# EAGLE design DOE PCB Schematics (EAGLE 9.5.2)
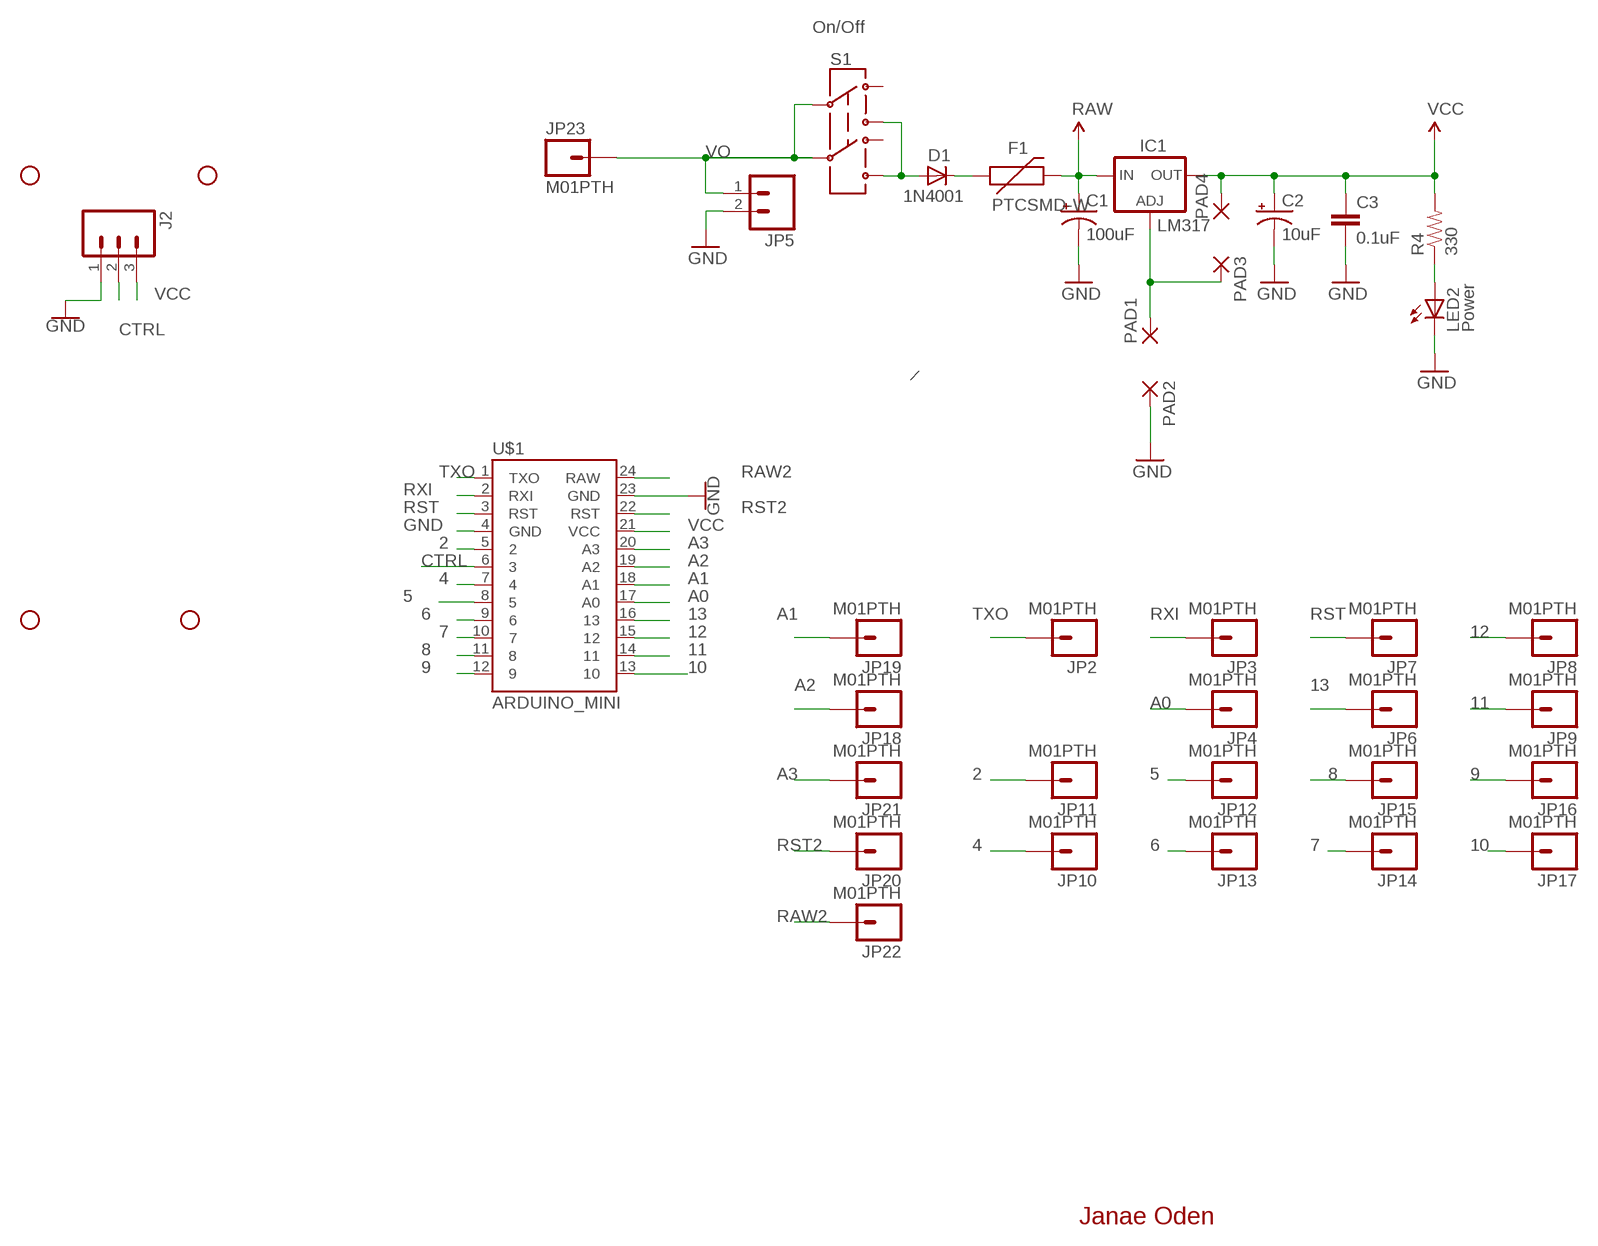
[diagram p0: schematic, sheet 1]

## Parts
C1  100uF  CAP_POL7343  [EIA7343]
C2  10uF  CAP_POL1206  [EIA3216]
C3  0.1uF  CAP0603-CAP  [0603-CAP]
D1  1N4001  DIODESMA-TYLERALT1  [SMA-DIODE-TYLERALT1]
F1  PTCSMD-W  [PTC-1206-WIDE]
IC1  LM317MBSTT3  [SOT223]
J2  M03SCREW  [SCREWTERMINAL-3.5MM-3]
JP2  M01PTH  [1X01]
JP3  M01PTH  [1X01]
JP4  M01PTH  [1X01]
JP5  M02PTH  [1X02]
JP6  M01PTH  [1X01]
JP7  M01PTH  [1X01]
JP8  M01PTH  [1X01]
JP9  M01PTH  [1X01]
JP10  M01PTH  [1X01]
JP11  M01PTH  [1X01]
JP12  M01PTH  [1X01]
JP13  M01PTH  [1X01]
JP14  M01PTH  [1X01]
JP15  M01PTH  [1X01]
JP16  M01PTH  [1X01]
JP17  M01PTH  [1X01]
JP18  M01PTH  [1X01]
JP19  M01PTH  [1X01]
JP20  M01PTH  [1X01]
JP21  M01PTH  [1X01]
JP22  M01PTH  [1X01]
JP23  M01PTH  [1X01]
LED2  Power  LED1206  [LED-1206]
PAD1  1,6/0,8  [1,6/0,8]
PAD2  1,6/0,8  [1,6/0,8]
PAD3  1,6/0,8  [1,6/0,8]
PAD4  1,6/0,8  [1,6/0,8]
R4  330  RESISTOR0603-RES  [0603-RES]
S1  On/Off  AYZ0202  [AYZ0202]
U$1  ARDUINO_MINI  [ARDUINO_MINI]
U$3  STAND-OFF  [STAND-OFF]
U$4  STAND-OFF  [STAND-OFF]
U$5  STAND-OFF  [STAND-OFF]
U$7  STAND-OFF  [STAND-OFF]

## Nets
2: JP11.1 U$1.5
4: JP10.1 U$1.7
5: JP12.1 U$1.8
6: JP13.1 U$1.9
7: JP14.1 U$1.10
8: JP15.1 U$1.11
9: JP16.1 U$1.12
10: JP17.1 U$1.13
11: JP9.1 U$1.14
12: JP8.1 U$1.15
13: JP6.1 U$1.16
A0: JP4.1 U$1.17(A0)
A1: JP19.1 U$1.18(A1)
A2: JP18.1 U$1.19(A2)
A3: JP21.1 U$1.20(A3)
CTRL: J2.2 U$1.6
GND: C1.C(-) C2.C(-) C3.2 J2.1 JP5.2 LED2.C PAD2.1(P) U$1.4(GND) U$1.23(GND)
N$1: D1.C F1.1
N$2: D1.A S1.1 S1.4
N$3: IC1.1(ADJ) PAD1.1(P) PAD3.1(P)
N$8: LED2.A R4.1
RAW: C1.A(+) F1.2 IC1.3(IN)
RAW2: JP22.1 U$1.24(RAW)
RST: JP7.1 U$1.3(RST)
RST2: JP20.1 U$1.22(RST)
RXI: JP3.1 U$1.2(RXI)
TXO: JP2.1 U$1.1(TXO)
VCC: C2.A(+) C3.1 IC1.4(OUT) J2.3 PAD4.1(P) R4.2 U$1.21(VCC)
VO: JP5.1 JP23.1 S1.2 S1.5
Unconnected: S1.3 S1.6

## Notes on the sheet
- Janae Oden

## Library data of the parts
C1 C2 = SparkFun:CAP_POL: Capacitor Polarized These are standard SMD and PTH capacitors. Normally 10uF, 47uF, and 100uF in electrolytic and tantalum varieties. Always verify the external diameter of the through hole cap, it varies with capacity, voltage, and manufacturer. The EIA devices should be standard.
C3 = SparkFun:CAP: Capacitor Standard 0603 ceramic capacitor, and 0.1" leaded capacitor.
D1 = Testing:DIODE: Diode These are standard reverse protection diodes and small signal diodes. SMA package can handle up to about 1A. SOD-323 can handle about 200mA. What the SOD-323 package when ordering, there are some mfgs out there that are 5-pin packages.
F1 = SparkFun-PowerIC:PTC: Resettable Fuse PTC Resettable Fuse. Spark Fun Electronics SKU : COM-08357
IC1 = v-reg:LM317?*: 500 mA Adjustable Output Positive Voltage Regulator Source: http://www.onsemi.co.jp .. LM317M-D.PDF; PARTNUMBER: LM317
J2 = SparkFun-Connectors:M03: Header 3 Standard 3-pin 0.1" header. Use with straight break away headers (SKU : PRT-00116), right angle break away headers (PRT-00553), swiss pins (PRT-00743), machine pins (PRT-00117), and female headers (PRT-00115). Molex polarized connector foot print use with SKU : PRT-08232 with associated crimp pins and housings.; PROD_ID: CONN-08288
JP2-JP4 JP6-JP23 = SparkFun:M01: Header 1 Standard 1-pin 0.1" header. Use with straight break away headers (SKU : PRT-00116), right angle break away headers (PRT-00553), swiss pins (PRT-00743), machine pins (PRT-00117), and female headers (PRT-00115).
JP5 = SparkFun:M02: Header 2 Standard 2-pin 0.1" header. Use with straight break away headers (SKU : PRT-00116), right angle break away headers (PRT-00553), swiss pins (PRT-00743), machine pins (PRT-00117), and female headers (PRT-00115). Molex polarized connector foot print use with SKU : PRT-08233 with associated crimp pins and housings.
LED2 = SparkFun-Nate:LED
PAD1-PAD4 = wirepad:1,6/0,8: THROUGH-HOLE PAD
R4 = SparkFun:RESISTOR: Resistor Basic schematic elements and footprints for 0603, 1206, and PTH resistors.
S1 = SparkFun:AYZ0202: SPDT Slide Switch Simple SMD single-pull double-throw slide switch. Good for less than 350mA power switch, switching UARTs between devices, etc. Spark Fun Electronics SKU : COM-00597
U$1 = SparkFun-Retired:ARDUINO_MINI: Arduino Pro Mini footprint
U$3-U$5 U$7 = SparkFun:STAND-OFF: Stand Off This is the mechanical footprint for a #4 phillips button head screw. Use the keepout ring to avoid running the screw head into surrounding components. SKU : PRT-00447

## Net classes
0 default: clearance 0.205 mm

## Board
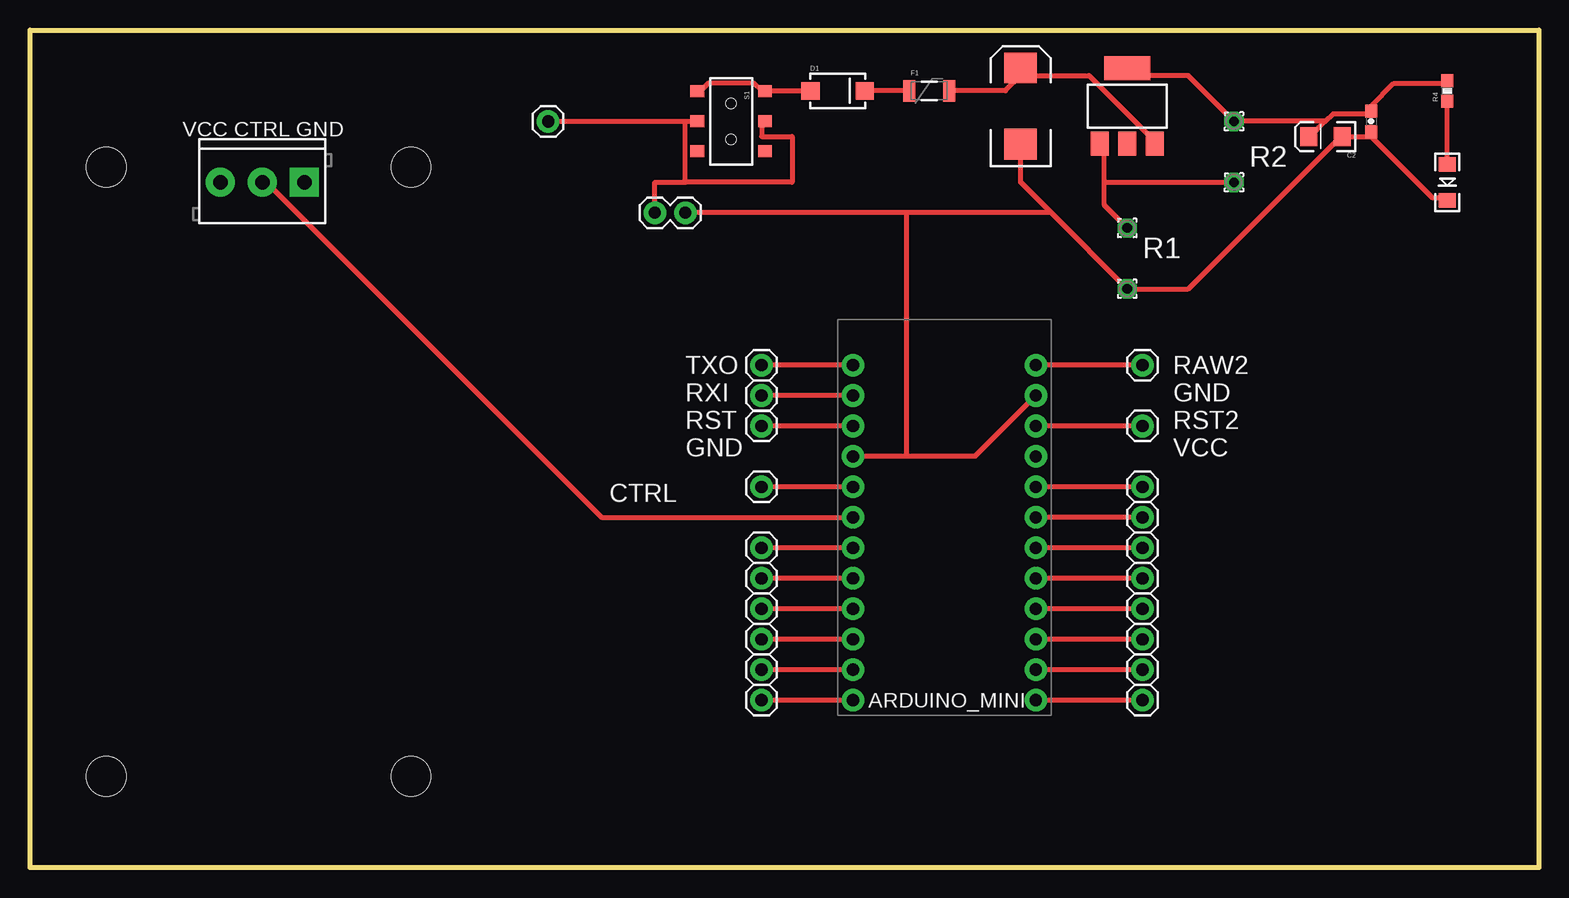
[diagram p1: board, top side]
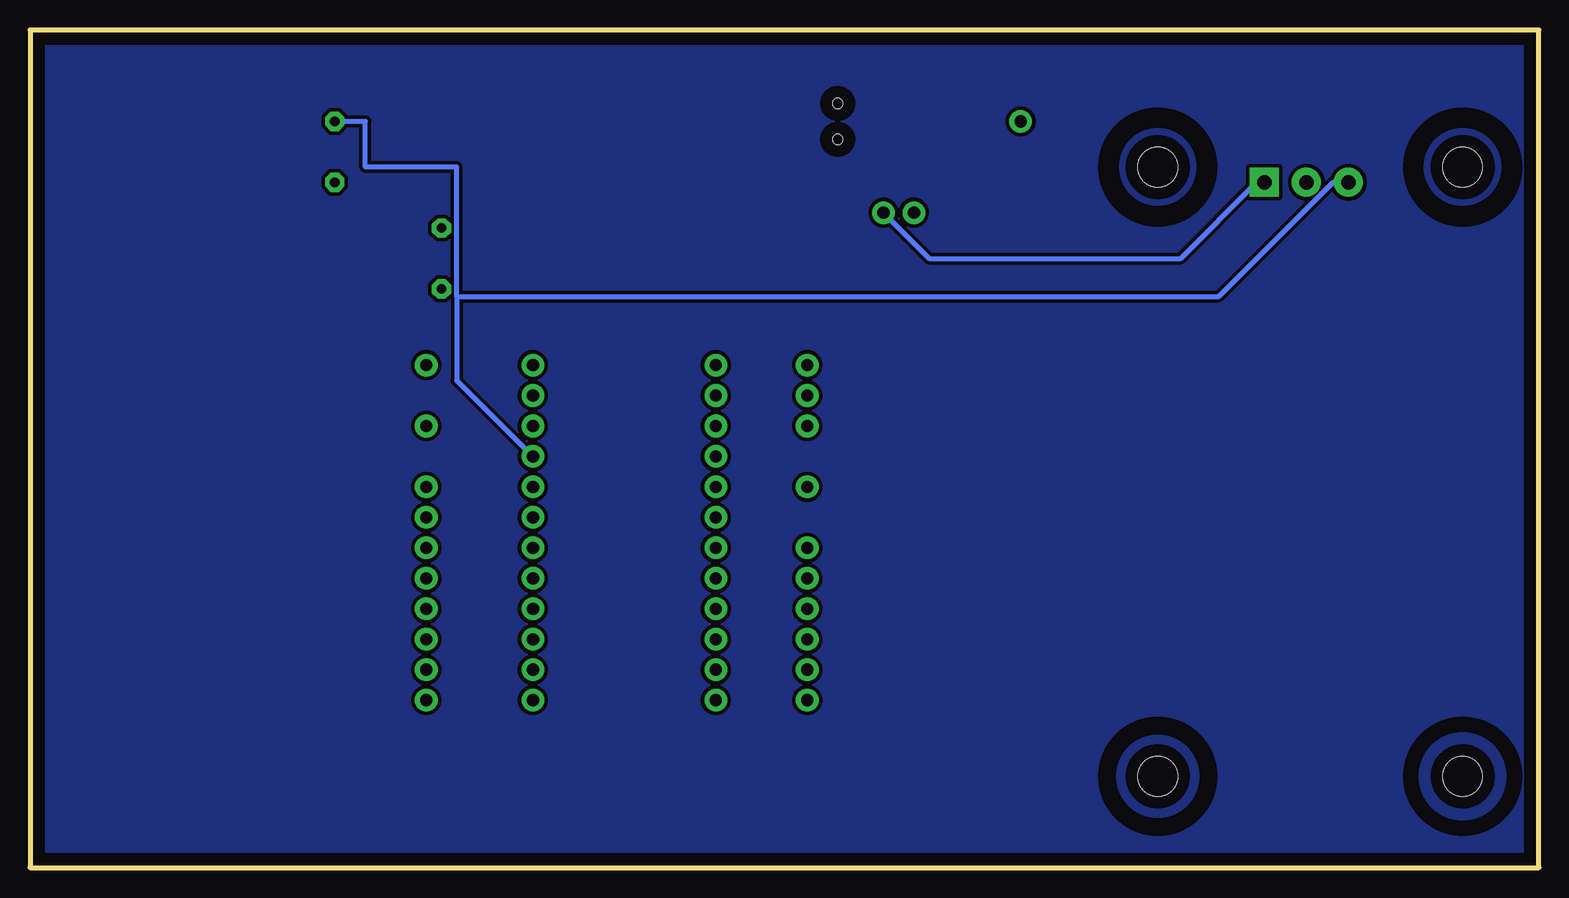
[diagram p2: board, bottom side, seen from below]

Size 125.73 x 69.85 mm. Coordinates in mm from the lower left corner, seen from the top.
Outline: 0,0 0,69.85 125.73,69.85 125.73,0 0,0
Copper layers (1*16): Top 0.035mm / dielectric 1.5mm / Bottom 0.035mm
Design rules "default": minimum track width 6mil, minimum drill 0.35mm, track to track 6mil, track to pad 6mil, pad to pad 6mil, via to via 6mil, smd to smd 6mil, copper to edge 40mil, drill to drill 6mil, minimum pad ring 10mil, minimum via ring 8mil, stop-mask expansion 4mil, vias tented up to drill 0mil, thermal gap 10mil
bRestrict: area 1.8,53.8 to 10.9,63; area 27.2,53.8 to 36.3,63; area 2.8,54.8 to 9.9,62; area 1.8,3 to 10.9,12.2; area 2.3,3.6 to 10.4,11.6; area 27.2,3 to 36.3,12.2; area 27.7,3.6 to 35.8,11.6; area 28.2,54.8 to 35.3,62; area 1.8,53.8 to 10.9,63; area 2.5,54.6 to 10.2,62.2; area 2.3,54.4 to 10.4,62.4; area 2.3,54.4 to 10.4,62.4; 4 more areas

### Footprints (pad centres in the part's own frame; a part is rotated, then mirrored left to right if it is on the bottom)
EIA7343 = smd 2.55 x 2.7: A 3.17,0; C -3.17,0
EIA3216 = smd 1.4 x 1.6: A 1.4,0; C -1.4,0
0603-CAP = smd 1.1 x 1: 1 -0.85,0; 2 0.85,0
SMA-DIODE-TYLERALT1 = smd 1.524 x 1.47: A -2.261,0; C 2.261,0
PTC-1206-WIDE = smd 1 x 1.8: 1 -1.654,0; 2 1.654,0
SOT223 = smd 1.5 x 2: 1 -2.3,-3.15; 2 0,-3.15; 3 2.3,-3.15 | smd 3.8 x 2: 4 0,3.15
SCREWTERMINAL-3.5MM-3 = drill 1.2 pad 2.413 square: 1 0,0 | drill 1.2 pad 2.413: 2 3.5,0; 3 7,0
1X01 = drill 1.016 pad 1.88: 1 0,0
1X02 = drill 1.016 pad 1.88: 1 0,0; 2 2.54,0
LED-1206 = smd 1.2 x 1.4: A -1.5,0; C 1.5,0
1,6/0,8 = drill 0.813 pad 1.6 octagon: 1 0,0
0603-RES = smd 1.1 x 1: 1 -0.85,0; 2 0.85,0
AYZ0202 = smd 1 x 1.15: 1 -2.5,2.825; 2 0,2.825; 3 2.5,2.825; 4 -2.5,-2.825; 5 0,-2.825; 6 2.5,-2.825 | hole 0.85: 1.5,0; -1.5,0
ARDUINO_MINI = drill 1.016 pad 1.88: 1 -7.62,12.7; 2 -7.62,10.16; 3 -7.62,7.62; 4 -7.62,5.08; 5 -7.62,2.54; 6 -7.62,0; 7 -7.62,-2.54; 8 -7.62,-5.08; 9 -7.62,-7.62; 10 -7.62,-10.16; 11 -7.62,-12.7; 12 -7.62,-15.24; 13 7.62,-15.24; 14 7.62,-12.7; 15 7.62,-10.16; 16 7.62,-7.62; 17 7.62,-5.08; 18 7.62,-2.54; 19 7.62,0; 20 7.62,2.54; 21 7.62,5.08; 22 7.62,7.62; 23 7.62,10.16; 24 7.62,12.7
STAND-OFF = hole 3.302: 0,0

### Placement (x,y rotation side)
C1  82.55,63.5 90 top
C2  107.95,60.96 180 top
C3  111.76,62.23 270 top
D1  67.31,64.77 0 top
F1  74.93,64.77 0 top
IC1  91.44,63.5 0 top
J2  22.86,57.15 180 top
JP2  60.96,41.91 0 top
JP3  60.96,39.37 0 top
JP4  92.71,24.13 0 top
JP5  52.07,54.61 0 top
JP6  92.71,21.59 0 top
JP7  60.96,36.83 0 top
JP8  92.71,19.05 0 top
JP9  92.71,16.51 0 top
JP10  60.96,26.67 0 top
JP11  60.96,31.75 0 top
JP12  60.96,24.13 0 top
JP13  60.96,21.59 0 top
JP14  60.96,19.05 0 top
JP15  60.96,16.51 0 top
JP16  60.96,13.97 0 top
JP17  92.71,13.97 0 top
JP18  92.71,29.21 0 top
JP19  92.71,26.67 0 top
JP20  92.71,36.83 0 top
JP21  92.71,31.75 0 top
JP22  92.71,41.91 0 top
JP23  43.18,62.23 0 top
LED2  118.11,57.15 270 top
PAD1  91.44,53.34 0 top
PAD2  91.44,48.26 0 top
PAD3  100.33,57.15 0 top
PAD4  100.33,62.23 0 top
R4  118.11,64.77 90 top
S1  58.42,62.23 270 top
U$1  76.2,29.21 0 top
U$3  6.35,58.42 0 top
U$4  31.75,58.42 0 top
U$5  6.35,7.62 0 top
U$7  31.75,7.62 0 top

### Tracks (layer width: path | path; a pad name or v marks a point on that pad's centre or on a via)
2
  Top 0.406: U$1.5 JP11.1
4
  Top 0.406: U$1.7 JP10.1
5
  Top 0.406: U$1.8 JP12.1
6
  Top 0.406: U$1.9 JP13.1
7
  Top 0.406: U$1.10 JP14.1
8
  Top 0.406: U$1.11 JP15.1
9
  Top 0.406: U$1.12 JP16.1
10
  Top 0.406: JP17.1 U$1.13
11
  Top 0.406: JP9.1 U$1.14
12
  Top 0.406: JP8.1 U$1.15
13
  Top 0.406: JP6.1 U$1.16
A0
  Top 0.406: JP4.1 U$1.17
A1
  Top 0.406: JP19.1 U$1.18
A2
  Top 0.406: JP18.1 U$1.19
A3
  Top 0.406: JP21.1 U$1.20
COPPER_POUR
  pour Bottom (isolate 0.305): 0,69.85 0,0 125.73,0 125.73,69.85
CTRL
  Top 0.406: U$1.6 47.62,29.21 19.68,57.15 J2.2
GND
  Top 0.406: 73.03,34.29 78.74,34.29 U$1.23 | 73.03,34.29 U$1.4 | 111.76,60.96 C2.C 109.22,60.96 96.52,48.26 PAD2.1 85.09,54.61 | 111.76,60.96 116.84,55.88 118.11,55.88 LED2.C | 111.76,60.96 C3.2 | C1.C 82.55,57.15 85.09,54.61 | 85.09,54.61 73.03,54.61 | 73.03,54.61 JP5.2 | 73.03,54.61 73.03,34.29
  Bottom 0.406: J2.1 23.5,57.15 29.84,50.8 50.8,50.8 JP5.2
N$1
  Top 0.406: F1.1 D1.C
N$2
  Top 0.406: S1.4 55.88,64.77 56.52,65.41 60.33,65.41 60.96,64.77 S1.1 61.59,64.77 D1.A
N$3
  Top 0.406: 89.53,57.15 89.53,55.24 PAD1.1 | 89.53,57.15 89.53,60.33 IC1.1 | 89.53,57.15 PAD3.1
N$8
  Top 0.406: LED2.A R4.1
RAW
  Top 0.406: F1.2 81.28,64.77 82.55,66.04 | 82.55,66.04 88.27,66.04 93.34,60.96 IC1.3 | 82.55,66.04 C1.A
RAW2
  Top 0.406: JP22.1 U$1.24
RST
  Top 0.406: U$1.3 JP7.1
RST2
  Top 0.406: JP20.1 U$1.22
RXI
  Top 0.406: U$1.2 JP3.1
TXO
  Top 0.406: U$1.1 JP2.1
VCC
  Top 0.406: 107.95,62.23 106.68,60.96 C2.A | 107.95,62.23 108.58,62.87 111.76,62.87 C3.1 111.76,63.5 113.67,65.41 118.11,65.41 R4.2 | 107.95,62.23 PAD4.1 96.52,66.04 91.44,66.04 IC1.4
  Bottom 0.406: U$1.21 90.17,40.64 90.17,47.62 | 90.17,47.62 90.17,58.42 97.79,58.42 97.79,62.23 PAD4.1 | J2.3 17.14,57.15 26.67,47.62 90.17,47.62
VO
  Top 0.406: JP23.1 54.61,62.23 | 54.61,62.23 S1.5 | S1.2 60.96,62.23 60.96,60.96 63.5,60.96 63.5,57.15 54.61,57.15 | 54.61,57.15 54.61,62.23 | JP5.1 52.07,57.15 54.61,57.15

### Text on the board
tPlace: VCC CTRL GND | R2 | R1 | TXO / RXI / RST / GND | RAW2 / GND / RST2 / VCC | CTRL